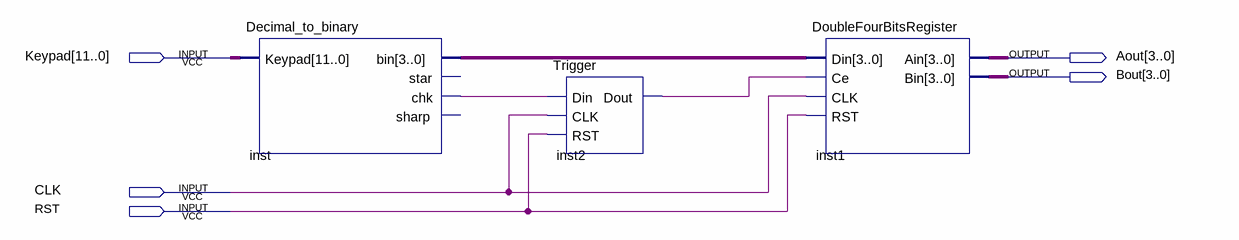
[diagram p0: schematic sheet]
// Quartus schematic FPGAKeypadBinaryShiftRegisterLED.bdf as structural Verilog: 3 symbols, 5 pins
module FPGAKeypadBinaryShiftRegisterLED (
  input  [11:0] Keypad,
  input  CLK,
  input  RST,
  output [3:0] Aout,
  output [3:0] Bout
);

  wire inst2_dout, inst_chk;
  wire [3:0] inst_bin;

  Decimal_to_binary inst (.Keypad(Keypad), .bin(inst_bin), .chk(inst_chk));  // open: star, sharp
  Trigger inst2 (.Din(inst_chk), .CLK(CLK), .RST(RST), .Dout(inst2_dout));
  DoubleFourBitsRegister inst1 (.Din(inst_bin), .Ce(inst2_dout), .CLK(CLK), .RST(RST), .Ain(Aout), .Bin(Bout));
endmodule
